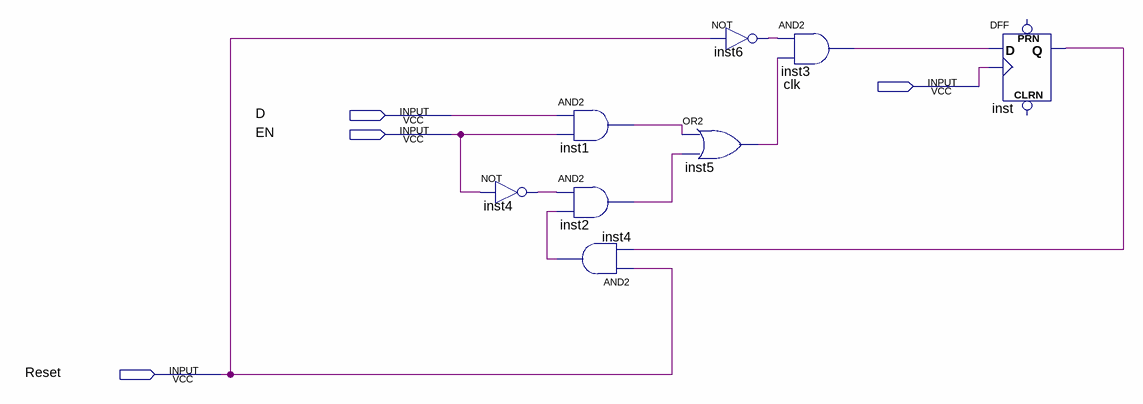
[diagram p0: schematic sheet]
// Quartus schematic specialdff.bdf as structural Verilog: 8 symbols, 4 pins
module specialdff (
  input  clk,
  input  D,
  input  EN,
  input  Reset
);

  wire inst1_out, inst2_out, inst3_out, inst4_out, inst4_out_2, inst5_out, inst6_out, inst_q;

  not inst4 (inst4_out, EN);
  and inst1 (inst1_out, D, EN);
  and inst2 (inst2_out, inst4_out, inst4_out_2);
  and inst4_dup2 (inst4_out_2, Reset, inst_q);
  not inst6 (inst6_out, Reset);
  or inst5 (inst5_out, inst1_out, inst2_out);
  and inst3 (inst3_out, inst6_out, inst5_out);
  DFF inst (.CLK(clk), .D(inst3_out), .Q(inst_q));  // open: CLRN, PRN
endmodule
